# EAGLE design Bolt (EAGLE 9.6.2)

## Sheet 1 of 3: Power supply
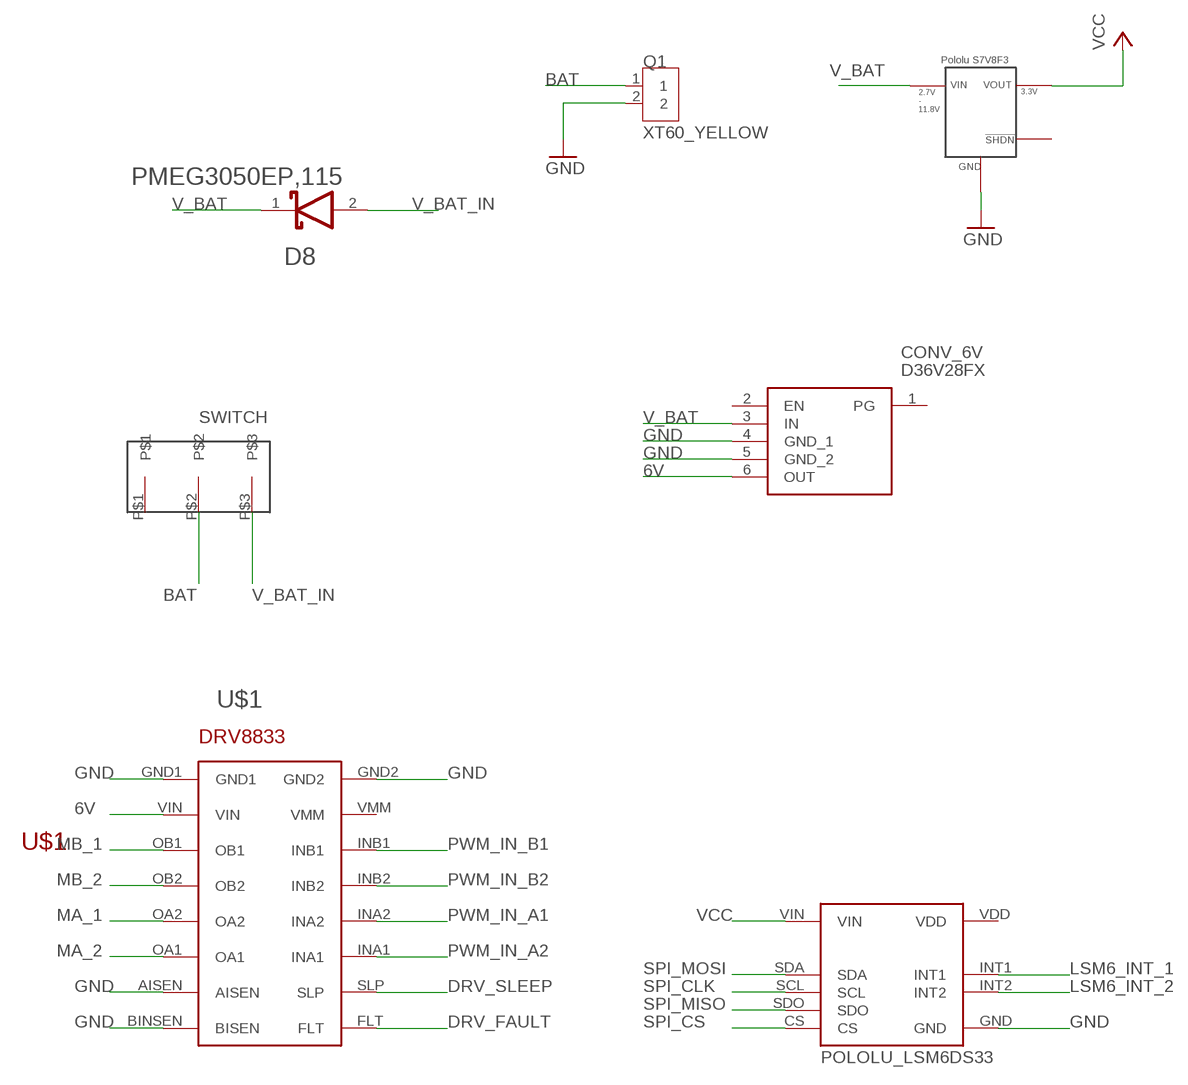
[diagram p0: schematic, sheet 1]

### Parts
CONV_3V3  S7V8F3  [S7V8F3]
CONV_6V  D36V28FX  [D36V28FX]
D8  NEXPERIA_PMEG3050EP,115NEXPERIA_PMEG3050EP,115_0_0  [NEXPERIA_PMEG3050EP,115_0]
Q1  XT60_YELLOW  [AMASS_XT60PB-M]
U$1  POLOLU-DRV8833  [POLOLU-DRV8833]
U$2  POLOLU_LSM6DS33  [POLOLU_LSM6DS33]
U$3  SWITCH  [SWITCH]

### Nets
6V: CONV_6V.6(OUT) U$1.VIN
BAT: Q1.1 U$3.P$2
DRV_FAULT: U$1.FLT ; also sheet 2
DRV_SLEEP: U$1.SLP ; also sheet 2
GND: CONV_3V3.GND CONV_6V.4(GND_1) CONV_6V.5(GND_2) Q1.2 U$1.AISEN U$1.BINSEN(BISEN) U$1.GND1 U$1.GND2 U$2.GND ; also sheet 2,3
LSM6_INT_1: U$2.INT1 ; also sheet 2
LSM6_INT_2: U$2.INT2 ; also sheet 2
MA_1: U$1.OA2 ; also sheet 3
MA_2: U$1.OA1 ; also sheet 3
MB_1: U$1.OB1 ; also sheet 3
MB_2: U$1.OB2 ; also sheet 3
PWM_IN_A1: U$1.INA2 ; also sheet 2
PWM_IN_A2: U$1.INA1 ; also sheet 2
PWM_IN_B1: U$1.INB1 ; also sheet 2
PWM_IN_B2: U$1.INB2 ; also sheet 2
SPI_CLK [SPI]: U$2.SCL ; also sheet 2
SPI_CS [SPI]: U$2.CS ; also sheet 2
SPI_MISO [SPI]: U$2.SDO ; also sheet 2
SPI_MOSI [SPI]: U$2.SDA ; also sheet 2
V_BAT: CONV_3V3.VIN CONV_6V.3(IN) D8.1(CATHODE)
V_BAT_IN: D8.2(ANODE) U$3.P$3
VCC: CONV_3V3.VOUT U$2.VIN ; also sheet 2,3
Unconnected: CONV_3V3.!SHDN CONV_6V.1(PG) CONV_6V.2(EN) U$1.VMM U$2.VDD U$3.P$1

## Sheet 2 of 3: MCU
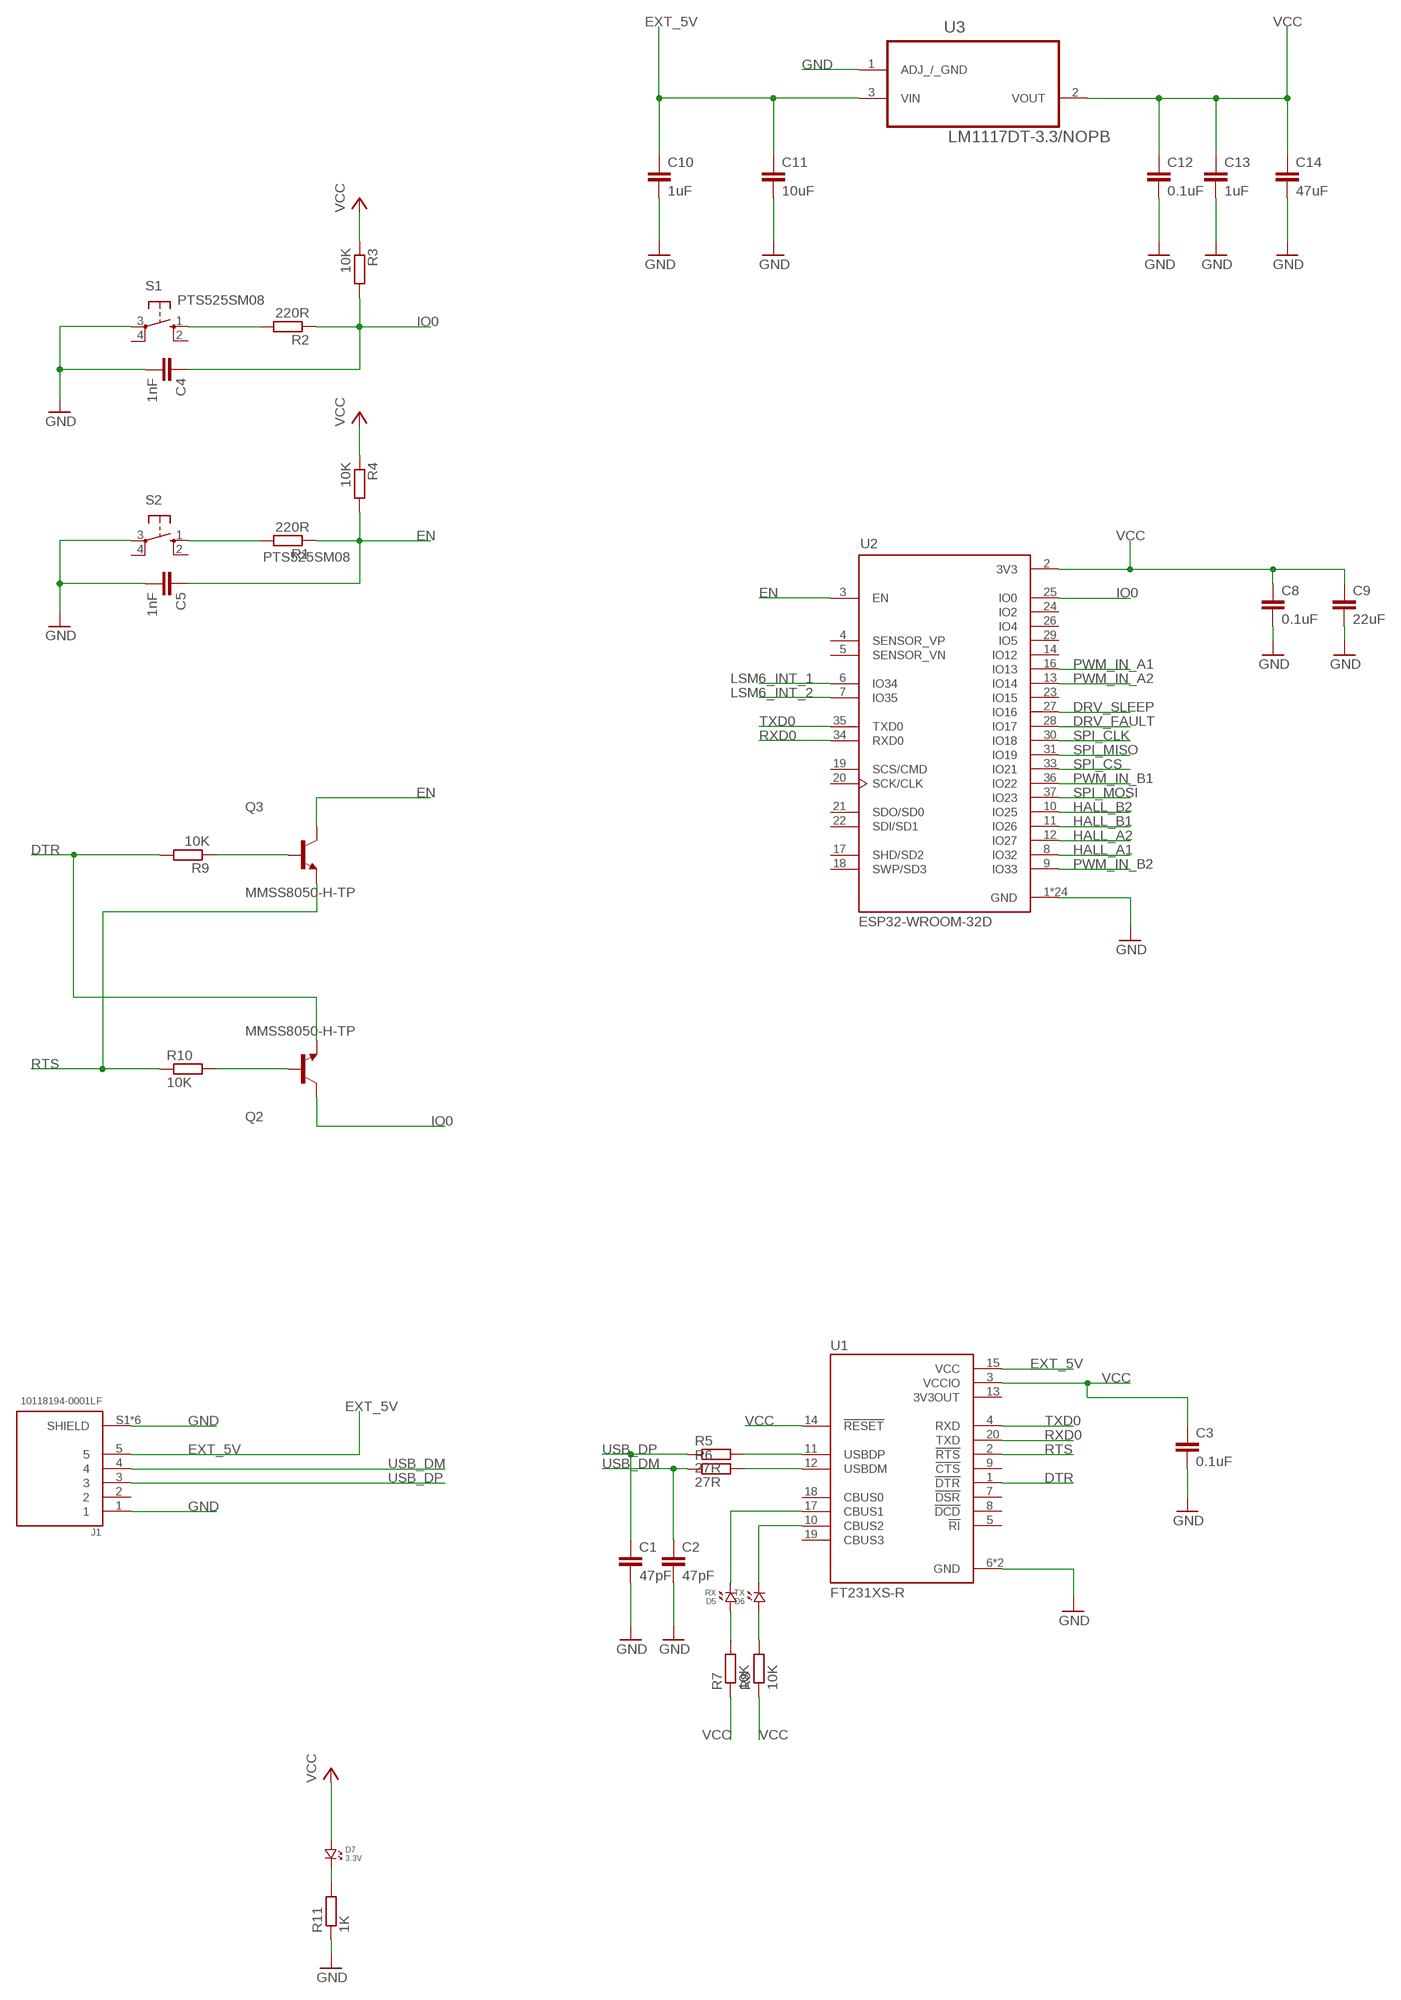
[diagram p1: schematic, sheet 2]

### Parts
C1  47pF  C-EUC0805K  [C0805K]
C2  47pF  C-EUC0805K  [C0805K]
C3  0.1uF  C-EUC0805K  [C0805K]
C4  1nF  C-EUC0805K  [C0805K]
C5  1nF  C-EUC0805K  [C0805K]
C8  0.1uF  C-EUC0805K  [C0805K]
C9  22uF  C-EUC0805K  [C0805K]
C10  1uF  C-EUC0805K  [C0805K]
C11  10uF  C-EUC0805K  [C0805K]
C12  0.1uF  C-EUC0805K  [C0805K]
C13  1uF  C-EUC0805K  [C0805K]
C14  47uF  C-EUC0805K  [C0805K]
D5  RX  LED.0805  [0805.LED]
D6  TX  LED.0805  [0805.LED]
D7  3.3V  LED.0805  [0805.LED]
J1  10118194-0001LF  [AMPHENOL_10118194-0001LF]
Q2  MMSS8050-H-TP  [TRANS_MMSS8050-H-TP]
Q3  MMSS8050-H-TP  [TRANS_MMSS8050-H-TP]
R1  220R  R-EU_R0805  [R0805]
R2  220R  R-EU_R0805  [R0805]
R3  10K  R-EU_R0805  [R0805]
R4  10K  R-EU_R0805  [R0805]
R5  27R  R-EU_R0805  [R0805]
R6  27R  R-EU_R0805  [R0805]
R7  10K  R-EU_R0805  [R0805]
R8  10K  R-EU_R0805  [R0805]
R9  10K  R-EU_R0805  [R0805]
R10  10K  R-EU_R0805  [R0805]
R11  1K  R-EU_R0805  [R0805]
S1  PTS525SM08  [SM08]
S2  PTS525SM08  [SM08]
U1  FT231XS-R  [SOP63P599X175-20N]
U2  ESP32-WROOM-32D  [MODULE_ESP32-WROOM-32D]
U3  LM1117DT-3.3/NOPB  [TO228P970X238-3N]

### Nets
DRV_FAULT: U2.28(IO17) ; also sheet 1
DRV_SLEEP: U2.27(IO16) ; also sheet 1
DTR: Q2.2(E) R9.2 U1.1(!DTR)
EN: C5.1 Q3.3(C) R1.1 R4.2 U2.3(EN)
EXT_5V: C10.1 C11.1 J1.5 U1.15(VCC) U3.3(VIN)
GND: C1.2 C2.2 C3.2 C4.2 C5.2 C8.2 C9.2 C10.2 C11.2 C12.2 C13.2 C14.2 J1.1 J1.S1(SHIELD) J1.S2(SHIELD) J1.S3(SHIELD) J1.S4(SHIELD) J1.S5(SHIELD) J1.S6(SHIELD) R11.1 S1.3(P) S2.3(P) U1.6(GND) U1.16(GND) U2.1(GND) U2.15(GND) U2.38(GND) U2.39_1(GND) U2.39_2(GND) U2.39_3(GND) U2.39_4(GND) U2.39_5(GND) U2.39_6(GND) U2.39_7(GND) U2.39_8(GND) U2.39_9(GND) U2.39_10(GND) U2.39_11(GND) U2.39_12(GND) U2.39_13(GND) U2.39_14(GND) U2.39_15(GND) U2.39_16(GND) U2.39_17(GND) U2.39_18(GND) U2.39_19(GND) U2.39_20(GND) U2.39_21(GND) U3.1(ADJ_/_GND) ; also sheet 1,3
HALL_A1: U2.8(IO32) ; also sheet 3
HALL_A2: U2.12(IO27) ; also sheet 3
HALL_B1: U2.11(IO26) ; also sheet 3
HALL_B2: U2.10(IO25) ; also sheet 3
IO0: C4.1 Q2.3(C) R2.1 R3.2 U2.25(IO0)
LSM6_INT_1: U2.6(IO34) ; also sheet 1
LSM6_INT_2: U2.7(IO35) ; also sheet 1
N$1: Q2.1(B) R10.2
N$28: D7.P$2 R11.2
N$35: D5.P$1 R7.2
N$55: R5.2 U1.11(USBDP)
N$56: R6.2 U1.12(USBDM)
N$61: R2.2 S1.1(S)
N$62: R1.2 S2.1(S)
N$124: Q3.1(B) R9.1
N$126: D5.P$2 U1.17(CBUS1)
N$127: D6.P$2 U1.10(CBUS2)
N$129: D6.P$1 R8.2
PWM_IN_A1: U2.16(IO13) ; also sheet 1
PWM_IN_A2: U2.13(IO14) ; also sheet 1
PWM_IN_B1: U2.36(IO22) ; also sheet 1
PWM_IN_B2: U2.9(IO33) ; also sheet 1
RTS: Q3.2(E) R10.1 U1.2(!RTS)
RXD0: U1.20(TXD) U2.34(RXD0)
SPI_CLK [SPI]: U2.30(IO18) ; also sheet 1
SPI_CS [SPI]: U2.33(IO21) ; also sheet 1
SPI_MISO [SPI]: U2.31(IO19) ; also sheet 1
SPI_MOSI [SPI]: U2.37(IO23) ; also sheet 1
TXD0: U1.4(RXD) U2.35(TXD0)
USB_DM: C2.1 J1.4 R6.1
USB_DP: C1.1 J1.3 R5.1
VCC: C3.1 C8.1 C9.1 C12.1 C13.1 C14.1 D7.P$1 R3.1 R4.1 R7.1 R8.1 U1.3(VCCIO) U1.14(!RESET) U2.2(3V3) U3.2(VOUT) ; also sheet 1,3
Unconnected: J1.2 S1.2(S) S1.4(P) S2.2(S) S2.4(P) U1.5(!RI) U1.7(!DSR) U1.8(!DCD) U1.9(!CTS) U1.18(CBUS0) U1.19(CBUS3) U2.4(SENSOR_VP) U2.5(SENSOR_VN) U2.14(IO12) U2.17(SHD/SD2) U2.18(SWP/SD3) U2.19(SCS/CMD) U2.20(SCK/CLK) U2.21(SDO/SD0) U2.22(SDI/SD1) U2.23(IO15) U2.24(IO2) U2.26(IO4) U2.29(IO5)

## Sheet 3 of 3: External pins
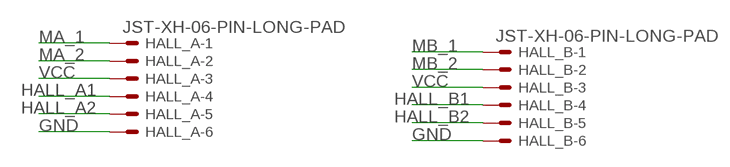
[diagram p2: schematic, sheet 3]

### Parts
HALL_A  JST-XH-06-PIN-LONG-PAD  [JST-XH-06-PACKAGE-LONG-PAD]
HALL_B  JST-XH-06-PIN-LONG-PAD  [JST-XH-06-PACKAGE-LONG-PAD]

### Nets
GND: HALL_A.6 HALL_B.6 ; also sheet 1,2
HALL_A1: HALL_A.4 ; also sheet 2
HALL_A2: HALL_A.5 ; also sheet 2
HALL_B1: HALL_B.4 ; also sheet 2
HALL_B2: HALL_B.5 ; also sheet 2
MA_1: HALL_A.1 ; also sheet 1
MA_2: HALL_A.2 ; also sheet 1
MB_1: HALL_B.1 ; also sheet 1
MB_2: HALL_B.2 ; also sheet 1
VCC: HALL_A.3 HALL_B.3 ; also sheet 1,2

## Power pins joined to a net without a drawn wire
3V3OUT: U1.13(3V3OUT)

## Library data of the parts
C1-C5 C8-C14 = rcl:C-EU: CAPACITOR, European symbol; SPICEPREFIX: C
CONV_3V3 = Pololu_S7V8F3:S7V8F3: Pololu S7V8F3 - Pololu 3.3V Step-Up/Step-Down Voltage Regulator S7V8F3 - The S7V8F3 switching step-up/step-down regulator efficiently produces a fixed 3.3 V output from input voltages between 2.7 V and 11.8 V. Its ability to convert both higher and lower input voltages makes it useful for applications where the power supply voltage can vary greatly, as with batteries that start above but discharge below the regulated voltage. The compact module has a typical efficiency of over 90% and can deliver 500 mA to 1 A across most of the input voltage range.
CONV_6V = D36V28FX:D36V28FX: 5V, 3.2A Step-Down Voltage Regulator D36V28F5 Source: Datasheet <https://www.pololu.com/product/3782>; DESCRIPTION: 5V, 3.2A Step-Down Voltage Regulator D36V28F5; HEIGHT: 8.77mm; MANUFACTURER_NAME: POLOLU ROBOTICS & ELECTRONICS; MANUFACTURER_PART_NUMBER: D36V28FX
D5-D7 = leds:LED
D8 = Nexperia - PMEG3050EP,115:NEXPERIA_PMEG3050EP,115: 5 A low VF MEGA Schottky barrier rectifier; AMBIENT_TEMPERATURE_RANGE_HIGH: +150°C; AMBIENT_TEMPERATURE_RANGE_LOW: -55°C; CENTROID_NOT_SPECIFIED: No; DATASHEET: https://assets.nexperia.com/documents/data-sheet/PMEG3050EP.pdf; DEVICE_CLASS_L1: Discrete Semiconductors; DEVICE_CLASS_L2: Diodes; DEVICE_CLASS_L3: Schottky Diodes; DIGIKEY_DESCRIPTION: DIODE SCHOTTKY 30V 5A SOD128; DIGIKEY_PART_NUMBER: 1727-5317-1-ND; FORWARD_CURRENT: 5A; HEIGHT: 1.1mm; LEAD_FREE: yes; MAX_JUNCTION_TEMP: +150°C; MAX_SURGE_FORWARD_CURRENT: 70A; MF: Nexperia; MFG_PACKAGE_IDENT: SOD128; MFG_PACKAGE_IDENT_DATE: 06/2017; MFG_PACKAGE_IDENT_REV: 0; MOUSER_PART_NUMBER: 771-PMEG3050EP115; MPN: PMEG3050EP,115; PACKAGE: CFP5; PEAK_REVERSE_CURRENT: 8mA; PREFIX: D; REVERSE_VOLTAGE: 30V; ROHS: yes; VERIFICATION_VERSION: 0.0.0.1
HALL_A HALL_B = Rembrandt Electronics - JST XH Connectors v1-0:JST-XH-06-PIN: JST XH Connector 2 Pin Wire to board connector. Pitch: 2,54 mm, (0.100") Number of pins: 6 Created by Rembrandt Electronics www.rembrandtelectronics.com
J1 = 10118194-0001LF:10118194-0001LF: Micro Usb, 2.0 Type b, Rcpt, Smt Check prices <https://pricing.snapeda.com/parts/10118194-0001LF/Amphenol%20ICC%20%28FCI%29/view-part?ref=eda>; AVAILABILITY: Good; DESCRIPTION: USB - micro B USB 2.0 Receptacle Connector 5 Position Surface Mount, Right Angle; Through Hole; MF: Amphenol ICC (FCI); MP: 10118194-0001LF; PACKAGE: None; PRICE: None; PURCHASE-URL: https://pricing.snapeda.com/search/part/10118194-0001LF/?ref=eda
Q1 = XT60_YELLOW:XT60_YELLOW: Connector 2 pins; AVAILABILITY: Unavailable; DESCRIPTION: Power connector; 65A; PIN: 2; Colour: yellow; MF: Pololu; MP: XT60 YELLOW; PACKAGE: None; PRICE: None
Q2 Q3 = MMSS8050-H-TP:MMSS8050-H-TP: MMSS8050-H Series 25 V 1.5 A NPN Silicon Plastic-Encapsulate Transistor-SOT-23 Check prices <https://pricing.snapeda.com/parts/MMSS8050-H-TP/Micro%20Commercial/view-part?ref=eda>; AVAILABILITY: Good; DESCRIPTION: Bipolar (BJT) Transistor NPN 25V 1.5A 100MHz 625mW Surface Mount SOT-23; MF: Micro Commercial; MP: MMSS8050-H-TP; PACKAGE: SOT-23 MCC; PRICE: None; PURCHASE-URL: https://pricing.snapeda.com/search/part/MMSS8050-H-TP/?ref=eda
R1-R11 = rcl:R-EU_: RESISTOR, European symbol; SPICEPREFIX: R
S1 S2 = pts525_20:PTS525*: PTS 525 Series Miniature Tact Switch for SMD Source: http://www.ck-components.com/14407/pts525_8sept14.pdf/; MF: C&K Components; MPN: PTS525SM08SMTR2LFS; OC_FARNELL: unknown; OC_NEWARK: unknown
U1 = FT231XS-R:FT231XS-R: USB Full Speed to Full Handshake UART with USB Charger Detection; DESCRIPTION: USB Bridge, USB to UART USB 2.0 UART Interface 20-SSOP; DIGI-KEY_PART_NUMBER: 768-1129-1-ND; MF: FTDI,; MP: FT231XS-R; PACKAGE: SSOP-20 FTDI; PURCHASE-URL: https://pricing.snapeda.com/search/part/FT231XS-R/?ref=eda
U2 = ESP32-WROOM-32D:ESP32-WROOM-32D: Bluetooth, WiFi 802.11b/g/n, Bluetooth v4.2 + EDR, Class 1, 2 and 3 Transceiver Module 2.4GHz ~ 2.5GHz Integrated, Trace Surface Mount Check prices <https://pricing.snapeda.com/parts/ESP32-WROOM-32D/Espressif%20Systems/view-part?ref=eda>; AVAILABILITY: Bad; DESCRIPTION: Bluetooth, WiFi 802.11b/g/n, Bluetooth v4.2 +EDR, Class 1, 2 and 3 Transceiver Module 2.4GHz ~ 2.5GHz Integrated, Trace Surface Mount; MF: Espressif Systems; MP: ESP32-WROOM-32D; PACKAGE: Module Espressif Systems; PRICE: None
U3 = LM1117DT-3.3_NOPB:LM1117DT-3.3/NOPB: IC, LDO VOLT REG, 3.3V, 0.8A Check prices <https://pricing.snapeda.com/parts/LM1117DT-3.3/NOPB/Texas%20Instruments/view-part?ref=eda>; AVAILABILITY: Good; DESCRIPTION: 800-mA 15-V linear voltage regulator 3-TO-252 0 to 125; MF: Texas Instruments; MP: LM1117DT-3.3/NOPB; PACKAGE: TO-252-3 Texas Instruments; PRICE: None; PURCHASE-URL: https://pricing.snapeda.com/search/part/LM1117DT-3.3/NOPB/?ref=eda
U$1 = DRV8833:POLOLU-DRV8833: Created by: Deltarios DRV8833 pololu dual drive controller, PCB-ready device
U$2 = lsm6ds33:POLOLU_LSM6DS33
U$3 = switch:SWITCH

## Board
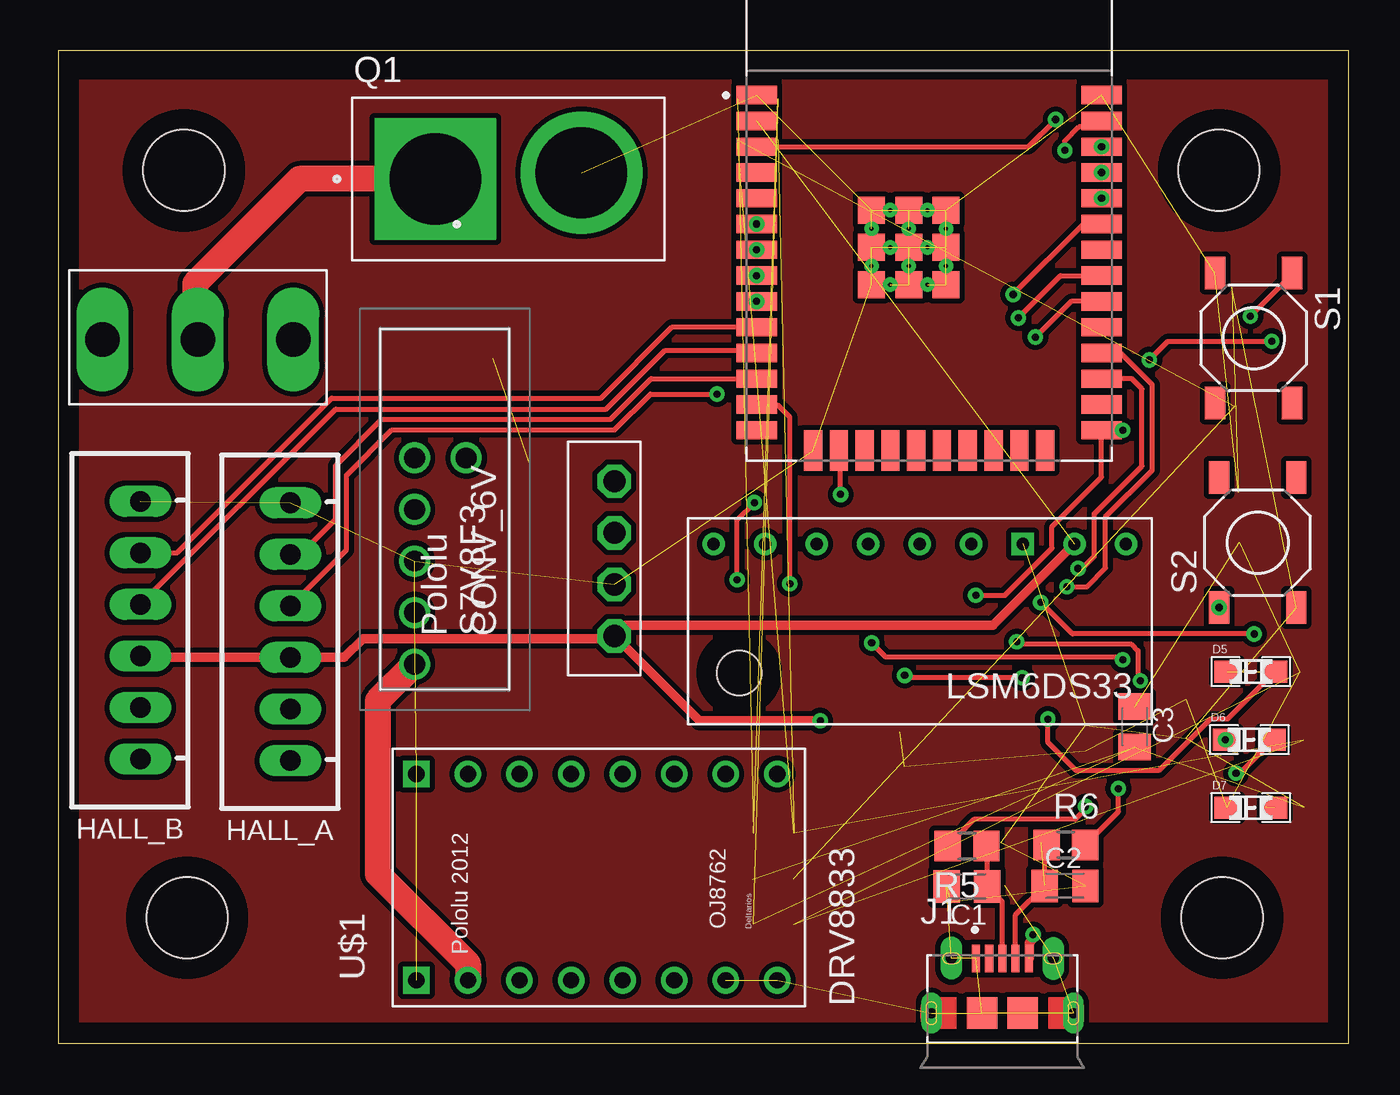
[diagram p3: board, top side]
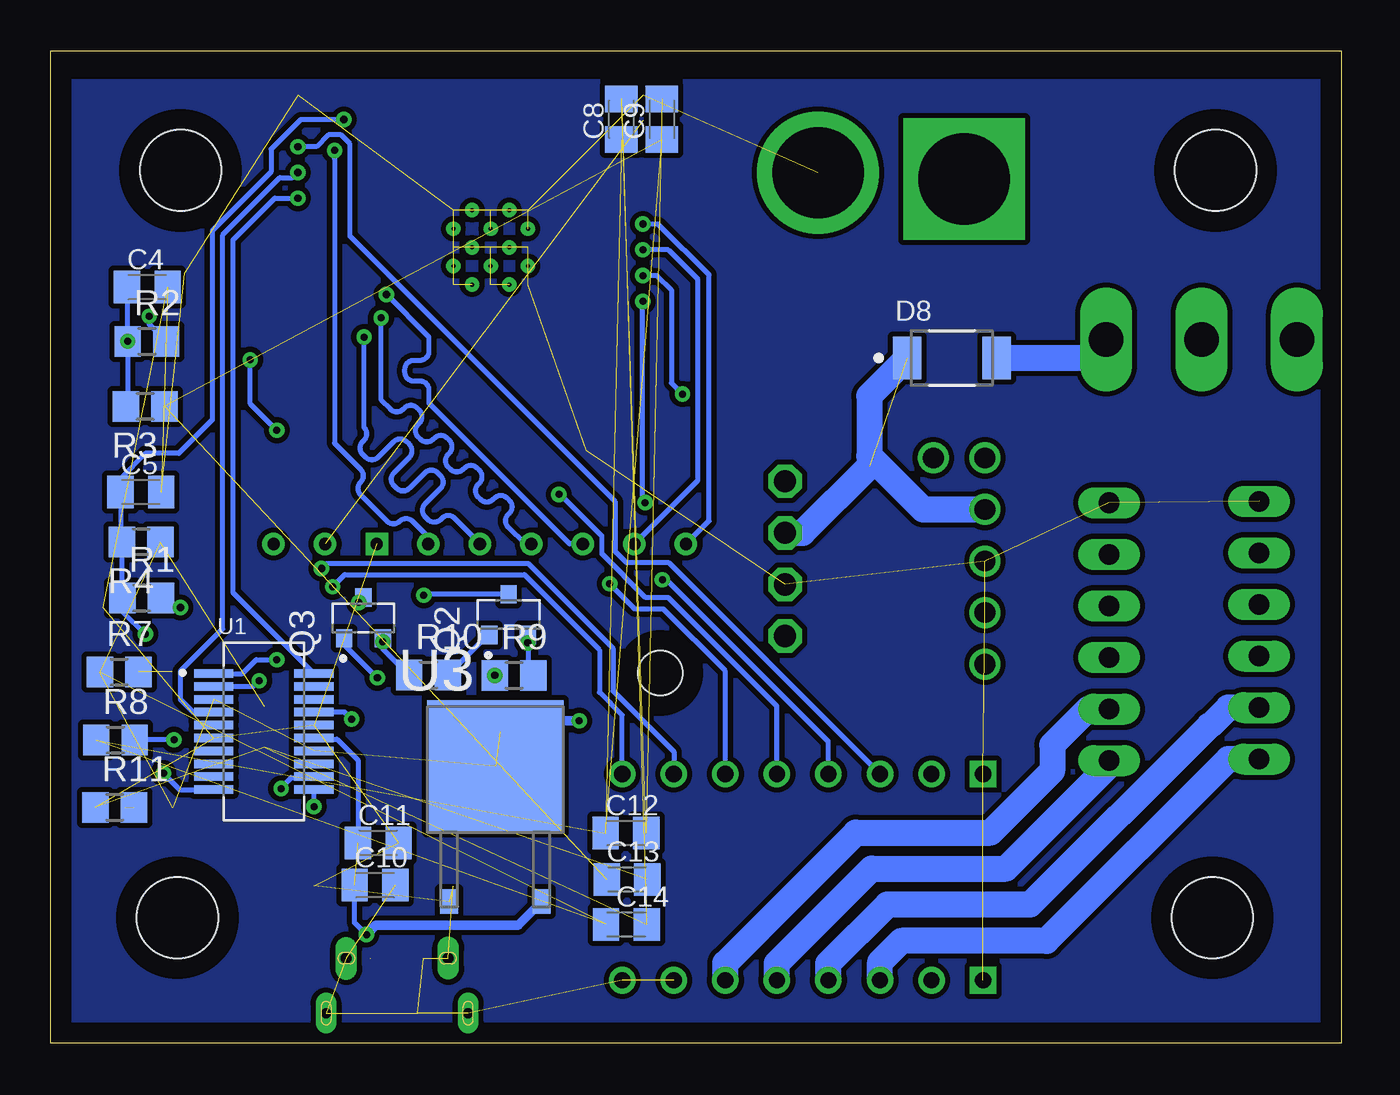
[diagram p4: board, bottom side, seen from below]

Size 63.59 x 48.9 mm. Coordinates in mm from the lower left corner, seen from the top.
Outline: 0,0 63.59,0 63.59,48.9 0,48.9 0,0
Copper layers (1*16): Top 0.035mm / dielectric 1.5mm / Bottom 0.035mm
Design rules "default *": minimum track width 6mil, minimum drill 0.35mm, track to track 10mil, track to pad 10mil, pad to pad 10mil, via to via 10mil, smd to smd 6mil, copper to edge 40mil, drill to drill 10mil, minimum pad ring 10mil, minimum via ring 8mil, stop-mask expansion 4mil, vias tented up to drill 0mil, thermal gap 10mil
Holes 4 mm at 6.35,6.19 6.19,43.01 57.19,43.01 57.35,6.19

### Footprints (pad centres in the part's own frame; a part is rotated, then mirrored left to right if it is on the bottom)
C0805K = smd 1.3 x 1.6: 1 -1,0; 2 1,0
S7V8F3 = drill 1.1 octagon: !SHDN 3.81,0; GND -1.27,0; VIN 1.27,0; VOUT -3.81,0
D36V28FX = drill 1.02 pad 1.53: 1 0,0; 2 0,-2.54; 3 2.54,-2.54; 4 5.08,-2.54; 5 7.62,-2.54; 6 10.16,-2.54
0805.LED = smd 1.25 x 1.1: P$1 -1.175,0; P$2 1.175,0
NEXPERIA_PMEG3050EP,115_0 = smd 1.4 x 2.1: 1 -2.2,0; 2 2.2,0
JST-XH-06-PACKAGE-LONG-PAD = drill 1.016 long: 1 -6.35,0; 2 -3.81,0; 3 -1.27,0; 4 1.27,0; 5 3.81,0; 6 6.35,0
AMPHENOL_10118194-0001LF = smd 0.4 x 1.35: 1 -1.3,2.7; 2 -0.65,2.7; 3 0,2.7; 4 0.65,2.7; 5 1.3,2.7 | drill 0.55 pad 0.65 long: S1 -2.511,2.706; S2 2.514,2.697 | drill 0.5 pad 0.775 long: S3 -3.5,0; S6 3.5,0 | smd 1.5 x 1.55: S4 -1,0; S5 1,0
AMASS_XT60PB-M = drill 4.5 pad 6 square: 1 -3.6,0 | drill 4.5 pad 6: 2 3.6,0.305
TRANS_MMSS8050-H-TP = smd 0.9 x 0.8: 1 -1,0.95; 2 -1,-0.95; 3 1,0
R0805 = smd 1.3 x 1.5: 1 -0.95,0; 2 0.95,0
SM08 = smd 1.6 x 1: 1 -3.2,1.9; 2 3.2,1.9; 3 -3.2,-1.9; 4 3.2,-1.9
SOP63P599X175-20N = smd 1.97 x 0.41: 1 -2.47,2.857; 2 -2.47,2.223; 3 -2.47,1.587; 4 -2.47,0.953; 5 -2.47,0.318; 6 -2.47,-0.318; 7 -2.47,-0.953; 8 -2.47,-1.587; 9 -2.47,-2.223; 10 -2.47,-2.857; 11 2.47,-2.857; 12 2.47,-2.223; 13 2.47,-1.587; 14 2.47,-0.953; 15 2.47,-0.318; 16 2.47,0.318; 17 2.47,0.953; 18 2.47,1.587; 19 2.47,2.223; 20 2.47,2.857
MODULE_ESP32-WROOM-32D = smd 2 x 0.9: 1 -8.5,5.26; 2 -8.5,3.99; 3 -8.5,2.72; 4 -8.5,1.45; 5 -8.5,0.18; 6 -8.5,-1.09; 7 -8.5,-2.36; 8 -8.5,-3.63; 9 -8.5,-4.9; 10 -8.5,-6.17; 11 -8.5,-7.44; 12 -8.5,-8.71; 13 -8.5,-9.98; 14 -8.5,-11.25; 25 8.5,-11.25; 26 8.5,-9.98; 27 8.5,-8.71; 28 8.5,-7.44; 29 8.5,-6.17; 30 8.5,-4.9; 31 8.5,-3.63; 32 8.5,-2.36; 33 8.5,-1.09; 34 8.5,0.18; 35 8.5,1.45; 36 8.5,2.72; 37 8.5,3.99; 38 8.5,5.26 | smd 0.9 x 2: 15 -5.715,-12.25; 16 -4.445,-12.25; 17 -3.175,-12.25; 18 -1.905,-12.25; 19 -0.635,-12.25; 20 0.635,-12.25; 21 1.905,-12.25; 22 3.175,-12.25; 23 4.445,-12.25; 24 5.715,-12.25 | smd 1.33 x 1.33: 39_1 -2.835,-0.405; 39_2 -1,-0.405; 39_3 0.835,-0.405; 39_4 -2.835,-2.24; 39_5 -1,-2.24; 39_6 0.835,-2.24; 39_7 -2.835,-4.075; 39_8 -1,-4.075; 39_9 0.835,-4.075 | drill 0.2 pad 0.3: 39_10 -1.917,-0.405; 39_11 -0.083,-0.405; 39_12 -2.835,-1.323; 39_13 -1,-1.323; 39_14 0.835,-1.323; 39_15 -1.917,-2.24; 39_16 -0.083,-2.24; 39_17 -2.835,-3.158; 39_18 -1,-3.158; 39_19 0.835,-3.158; 39_20 -1.917,-4.075; 39_21 -0.083,-4.075
TO228P970X238-3N = smd 0.889 x 1.219: 1 -2.286,-6.502; 3 2.286,-6.502 | smd 6.731 x 6.502: 2 0,0.152
POLOLU-DRV8833 = drill 0.8: AISEN -3.81,-7.62; BINSEN -3.81,-10.16; FLT 6.35,-10.16; INA1 6.35,-5.08; INA2 6.35,-2.54; INB1 6.35,2.54; INB2 6.35,0; OA1 -3.81,-5.08; OA2 -3.81,-2.54; OB1 -3.81,2.54; OB2 -3.81,0; SLP 6.35,-7.62; VIN -3.81,5.08; VMM 6.35,5.08 | drill 0.8 square: GND1 -3.81,7.62; GND2 6.35,7.62
POLOLU_LSM6DS33 = drill 0.6: CS 1.27,-16.51; INT1 1.27,-21.59; INT2 1.27,-19.05; SCL 1.27,-11.43; SDA 1.27,-8.89; SDO 1.27,-13.97; VDD 1.27,-1.27; VIN 1.27,-3.81 | drill 0.6 square: GND 1.27,-6.35 | hole 2.184: 7.62,-20.32
SWITCH = drill 1.7 long: P$1 0,4.7; P$2 0,0; P$3 0,-4.7

### Placement (x,y rotation side)
C1  44.77,7.74 180 top
C2  49.61,7.77 0 top
C3  53.04,15.59 270 top
C4  58.83,37.25 0 bottom
C5  59.15,27.16 0 bottom
C8  35.47,45.52 90 bottom
C9  33.47,45.52 90 bottom
C10  47.62,7.8 0 bottom
C11  47.45,9.88 0 bottom
C12  35.25,10.36 0 bottom
C13  35.2,8.08 0 bottom
C14  35.23,5.86 0 bottom
CONV_3V3  27.41,23.88 90 top
CONV_6V  20.1,28.84 270 top
D5  58.77,18.31 0 top
D6  58.69,14.96 0 top
D7  58.76,11.61 0 top
D8  19.19,33.76 0 bottom
HALL_A  11.44,20.28 90 top
HALL_B  4.05,20.35 90 top
J1  46.52,1.49 0 top
Q1  22.18,42.58 0 top
Q2  41.03,21.12 90 bottom
Q3  48.18,20.96 90 bottom
R1  59.11,21.95 0 bottom
R2  58.85,34.59 0 bottom
R3  58.94,31.38 180 bottom
R4  59.14,24.7 180 bottom
R5  44.78,9.72 180 top
R6  49.65,9.79 0 top
R7  60.22,18.29 0 bottom
R8  60.4,14.94 0 bottom
R9  40.76,18.13 0 bottom
R10  44.98,18.14 0 bottom
R11  60.44,11.63 0 bottom
S1  58.9,34.74 270 top
S2  59.1,24.67 90 top
U1  53.09,15.36 0 bottom
U2  42.91,41.45 0 top
U3  41.68,13.49 0 bottom
U$1  25.27,6.92 90 top
U$2  53.88,25.87 270 top
U$3  6.88,34.67 90 top

### Tracks (layer width: path | path; a pad name or v marks a point on that pad's centre or on a via)
6V
  Top 1.27: CONV_6V.6 15.75,16.87 15.75,8.36 20.19,3.91 U$1.VIN
BAT
  Top 1.27: Q1.1 11.89,42.58 6.75,37.44 6.75,34.8 U$3.P$2
DRV_FAULT  (via drill 0.35)
  Top 0.254: v49.7,22.49 50.67,22.49 51.61,23.43 51.61,25.93 53.91,28.23 53.91,32.45 52.34,34.02 51.42,34.02 U2.28
  Bottom 0.254: U$1.FLT 35.43,16.17 36.55,17.29 36.55,19.39 40.25,23.09 49.1,23.09 v49.7,22.49
DRV_SLEEP  (via drill 0.35)
  Top 0.254: v50.25,23.39 50.45,23.39 51.05,23.99 51.05,26.09 53.4,28.44 53.4,32.24 52.9,32.74 U2.27
  Bottom 0.254: U$1.SLP 32.89,14.37 35.89,17.37 35.89,19.47 40.06,23.64 50,23.64 v50.25,23.39
DTR  (via drill 0.35)
  Top 0.254: v52.45,18.9 52.33,19.03 40.78,19.03 v40.08,19.73
  Bottom 0.254: Q2.2 v40.08,19.73 40.08,18.4 R9.2 | U1.1 54.15,18.22 53.47,18.9 v52.45,18.9
EN  (via drill 0.35)
  Top 0.254: v58.93,20.17 49.97,20.17 v48.41,21.73 | U2.3 47.81,44.17 v49.15,45.51
  Bottom 0.254: v58.93,20.17 60.06,21.3 R1.1 60.09,21.98 R4.2 60.15,24.76 C5.1 60.15,27.84 58.93,29.06 57.28,29.06 55.62,30.71 55.62,40.04 52.73,42.93 52.73,44.05 51.27,45.51 v49.15,45.51 | v48.41,21.73 Q3.3
EXT_5V  (via drill 0.35)  (2 unrouted)
  Top 0.457: v48.03,5.36 48.03,5.15 47.85,4.97 47.85,4.19
  Bottom 0.254: U1.15 50.57,15 49.49,15 48.45,13.96 C11.1 | v48.03,5.36 48.62,5.94 C10.1
  Bottom 0.457: U3.3 40.57,5.82 47.58,5.82 v48.03,5.36
GND  (59 unrouted)
GND1
  pour Bottom: -0.27,47.36 64.15,47.36 64.15,-0.32 -0.27,-0.32
  pour Top: -0.27,47.36 64.15,47.36 64.15,-0.32 -0.27,-0.32
HALL_A1  (via drill 0.35)
  Top 0.254: HALL_A.4 14.2,24.31 14.2,27.99 16.43,30.23 27.42,30.23 29.18,31.98 v32.46,31.98
  Bottom 0.254: v32.46,31.98 33.01,32.53 33.01,37.12 33.71,37.82 U2.8
  other vias: 34.41,37.82
HALL_A2
  Top 0.254: HALL_A.5 11.94,24.09 13.66,25.82 13.66,28.47 15.93,30.73 27.21,30.73 29.22,32.74 U2.12
HALL_B1
  Top 0.254: HALL_B.4 13.67,31.24 27,31.24 29.9,34.14 34.28,34.14 U2.11
HALL_B2
  Top 0.254: HALL_B.5 5.85,24.16 13.48,31.79 26.75,31.79 30.25,35.29 U2.10
IO0  (via drill 0.35)
  Top 0.254: v45.21,22.07 46.65,22.07 48.97,24.4 48.97,25.46 51.41,27.89 U2.25 v52.45,30.2 | v53.76,33.67 54.67,34.59 R2.1
  Bottom 0.254: C4.1 59.83,34.62 R2.1 59.8,31.47 R3.2 | Q2.3 45.16,22.12 v45.21,22.07 | v52.45,30.2 53.76,31.51 v53.76,33.67
  other vias: 59.8,34.59
LSM6_INT_1  (via drill 0.35)
  Bottom 0.254: U$2.INT1 31.15,25.74 31.15,37.85 33.66,40.36 U2.6
  other vias: 34.41,40.36
LSM6_INT_2  (via drill 0.35)
  Bottom 0.254: U$2.INT2 31.7,27.73 31.7,37.63 33.16,39.09 U2.7
  other vias: 34.41,39.09
MA_1
  Bottom 1.27: HALL_A.1 11.44,13.68 16.51,8.61 23.15,8.61 27.81,3.95 U$1.OA2
MA_2
  Bottom 1.27: HALL_A.2 12.48,16.47 14.24,14.71 14.24,13.43 17.28,10.39 23.91,10.39 30.35,3.95 U$1.OA1
MB_1
  Bottom 1.27: U$1.OB1 22.73,4 21.68,5.06 14.52,5.06 5.57,14 HALL_B.1
MB_2
  Bottom 1.27: U$1.OB2 25.27,3.94 22.37,6.83 15.33,6.83 6.51,15.65 6.46,15.65 5.57,16.54 HALL_B.2
N$1
  Bottom 0.254: Q2.1 42.05,20.12 R10.2
N$28  (1 unrouted)
N$35  (1 unrouted)
  Bottom 0.254: 59.25,18.31 R7.2
N$55  (via drill 0.35)
  Top 0.254: R5.2 44.7,10.59 44.7,10.63 45.11,11.03 50.11,11.03 50.62,11.54 v50.62,11.67
  Bottom 0.254: v50.62,11.67 U1.11
N$56  (via drill 0.35)
  Top 0.254: R6.2 52.24,11.42 v52.24,12.55
  Bottom 0.254: U1.12 50.67,13.09 51.75,13.09 52.24,12.6 v52.24,12.55
N$61  (via drill 0.35)
  Top 0.254: v58.74,35.82 60.8,37.88 S1.1
  Bottom 0.254: R2.2 58.74,35.43 v58.74,35.82
N$62  (via drill 0.35)
  Bottom 0.254: R1.2 57.68,21.47 S2.1
  other vias: 57.2,21.47
N$124  (via drill 0.35)
  Top 0.254: v47.5,18.01 41.83,18.01 R9.1
  Bottom 0.254: Q3.1 49.13,19.64 v47.5,18.01
  other vias: 41.71,18.13
N$126  (via drill 0.35)
  Top 0.254: D5.P$2 57.61,15.98 56.77,15.98 54.23,13.44 50.16,13.44 48.77,14.84 v48.77,15.98
  Bottom 0.254: v48.77,15.98 49.1,16.32 U1.17
N$127  (via drill 0.35)
  Top 0.254: D6.P$2 58.21,13.31 v58.04,13.31
  Bottom 0.254: v58.04,13.31 57.23,12.5 U1.10
N$129  (via drill 0.35)
  Bottom 0.254: D6.P$1 59.43,14.96 R8.2
  other vias: 57.52,14.96
PWM_IN_A1  (via drill 0.35)
  Top 0.254: v38.55,27.04 38.55,29.12 U2.16
  Bottom 0.254: v38.55,27.04 38.49,27.04 36.44,24.99 36.44,24.12 34.28,21.96 33.16,21.96 27.81,16.61 U$1.INA2
PWM_IN_A2  (via drill 0.35)
  Top 0.254: U2.13 34.45,31.43 35.47,31.43 36.05,30.85 v36.05,22.64
  Bottom 0.254: v36.05,22.64 34.8,21.39 33.38,21.39 30.35,18.35 U$1.INA1
PWM_IN_B1  (via drill 0.35)
  Bottom 0.254: U$1.INB1 33.12,23.67 35.22,23.67 35.77,24.22 35.77,26.68 48.84,39.76 48.84,44.31 49.29,44.75 49.91,44.75 50.49,44.17 U2.36
  other vias: 51.41,44.17
PWM_IN_B2  (via drill 0.35)
  Top 0.254: v34.3,26.64 33.45,25.79 v33.45,22.84
  Bottom 0.254: U$1.INB2 25.27,14.87 33.24,22.84 v33.45,22.84 | v34.3,26.64 34.45,26.79 34.45,36.51 U2.9
  other vias: 34.41,36.55
RTS  (via drill 0.35)
  Top 0.254: v47.23,19.79 47.36,19.66 52.89,19.66 53.21,19.34 53.21,17.98 v53.32,17.87
  Bottom 0.254: R10.1 47.23,19.44 v47.23,19.79 Q3.2 | U1.2 53.61,17.58 v53.32,17.87
RXD0  (via drill 0.35)
  Bottom 0.254: U1.20 54.61,22.21 54.61,39.58 52.55,41.63 U2.34
  other vias: 51.41,41.63
SPI_CLK  (via drill 0.35)
  Top 0.254: U2.30 49.91,36.55 v48.15,34.79
  Bottom 0.254: U$2.SCL 42.45,24.64 43.68,25.87 arc-90 44.31,25.87 44.38,25.81 arc90 45.01,25.81 45.15,25.95 arc90 45.15,26.57 44.38,27.34 arc-90 44.38,27.97 44.52,28.11 arc-90 45.15,28.11 45.91,27.34 arc90 46.54,27.34 46.68,27.48 arc90 46.68,28.11 45.92,28.87 arc-90 45.92,29.5 46.06,29.64 arc-90 46.69,29.64 47.45,28.88 arc90 48.08,28.88 48.22,29.02 arc90 48.22,29.65 48.15,29.71 arc-90 48.15,30.34 v48.15,34.79
SPI_CS  (via drill 0.35)
  Top 0.254: v47.05,36.89 50.52,40.36 U2.33
  Bottom 0.254: U$2.CS 38.02,24.6 44.95,31.53 44.95,32.18 arc-90 45.4,32.63 45.7,32.63 arc90 46.14,33.07 46.14,33.2 arc90 45.7,33.65 45.4,33.65 arc-90 44.95,34.09 44.95,34.79 v47.05,36.89
SPI_MISO  (via drill 0.35)
  Top 0.254: v47.31,35.74 49.39,37.82 U2.31
  Bottom 0.254: U$2.SDO 40.22,24.6 41.05,25.43 arc90 41.05,26.06 40.99,26.12 arc-90 40.99,26.75 41.1,26.86 arc-90 41.73,26.86 41.79,26.8 arc90 42.42,26.8 42.53,26.91 arc90 42.53,27.54 42.47,27.6 arc-90 42.47,28.23 42.58,28.34 arc-90 43.21,28.34 43.27,28.28 arc90 43.9,28.28 44.01,28.39 arc90 44.01,29.02 43.95,29.08 arc-90 43.95,29.71 44.06,29.82 arc-90 44.69,29.82 44.75,29.76 arc90 45.38,29.76 45.49,29.87 arc90 45.49,30.5 45.42,30.56 arc-90 45.42,31.19 45.54,31.3 arc-90 46.16,31.3 46.23,31.24 arc90 46.85,31.24 47.31,31.69 v47.31,35.74
SPI_MOSI  (via drill 0.35)
  Top 0.254: v49.6,43.99 49.6,44.44 50.3,45.14 51.11,45.14 U2.37
  Bottom 0.254: v49.6,43.99 49.6,43.61 49.61,43.6 49.61,29.57 48.31,28.28 arc90 48.31,27.65 arc-90 48.31,27.02 47.02,25.72 arc-90 46.39,25.72 arc90 45.76,25.72 44.99,24.95 U$2.SDA
TXD0  (via drill 0.35)
  Bottom 0.254: U1.4 56.58,16.32 57.21,16.95 57.21,18.33 55.12,20.42 55.12,39.83 52.3,42.65 51.66,42.65 U2.35
  other vias: 51.41,42.9
USB_DM
  Top 0.254: R6.1 48.61,9.69 C2.1 47.17,6.33 J1.4
USB_DP
  Top 0.254: J1.3 46.52,6.99 C1.1 45.77,9.69 R5.1
V_BAT  (1 unrouted)
  Bottom 1.27: D8.1 23.25,31.9 23.25,28.94 20.61,26.3 CONV_6V.3 | CONV_3V3.VIN 26.54,25.15 23.25,28.44
V_BAT_IN
  Bottom 1.27: U$3.P$3 12.49,33.76 D8.2
VCC  (via drill 0.35)  (15 unrouted)
  Top 0.457: HALL_B.3 4.12,19.01 HALL_A.3 14.09,19.01 15.01,19.93 27.27,19.93 CONV_3V3.VOUT | CONV_3V3.VOUT 27.93,20.59 46.06,20.59 U$2.VIN | v37.55,15.89 31.59,15.89 CONV_3V3.VOUT
  Bottom 0.457: v37.55,15.89 41.45,15.89 41.45,15.34